# Altium schematic sheet SH-C30A-V1.21.SchDoc
size 420 x 297 mm; Symbol: Sheet-Symbol_A3; Company: DSD TECH; Version: V1.0; Page Size: A3; @Page No: 1; @Page Name: P1; @Project Name: CANable; @Page Count: 1; @Update Date: 2022-07-10; @Create Date: 2022-06-27; @Schematic Name: CANable; Device: Sheet-Symbol_A3; Border: 1; Width: 1655; Height: 1170; Region Start: 1; X Region Count: 6; Y Region Count: 4; Blade Width: 10; Title Block Position: 3
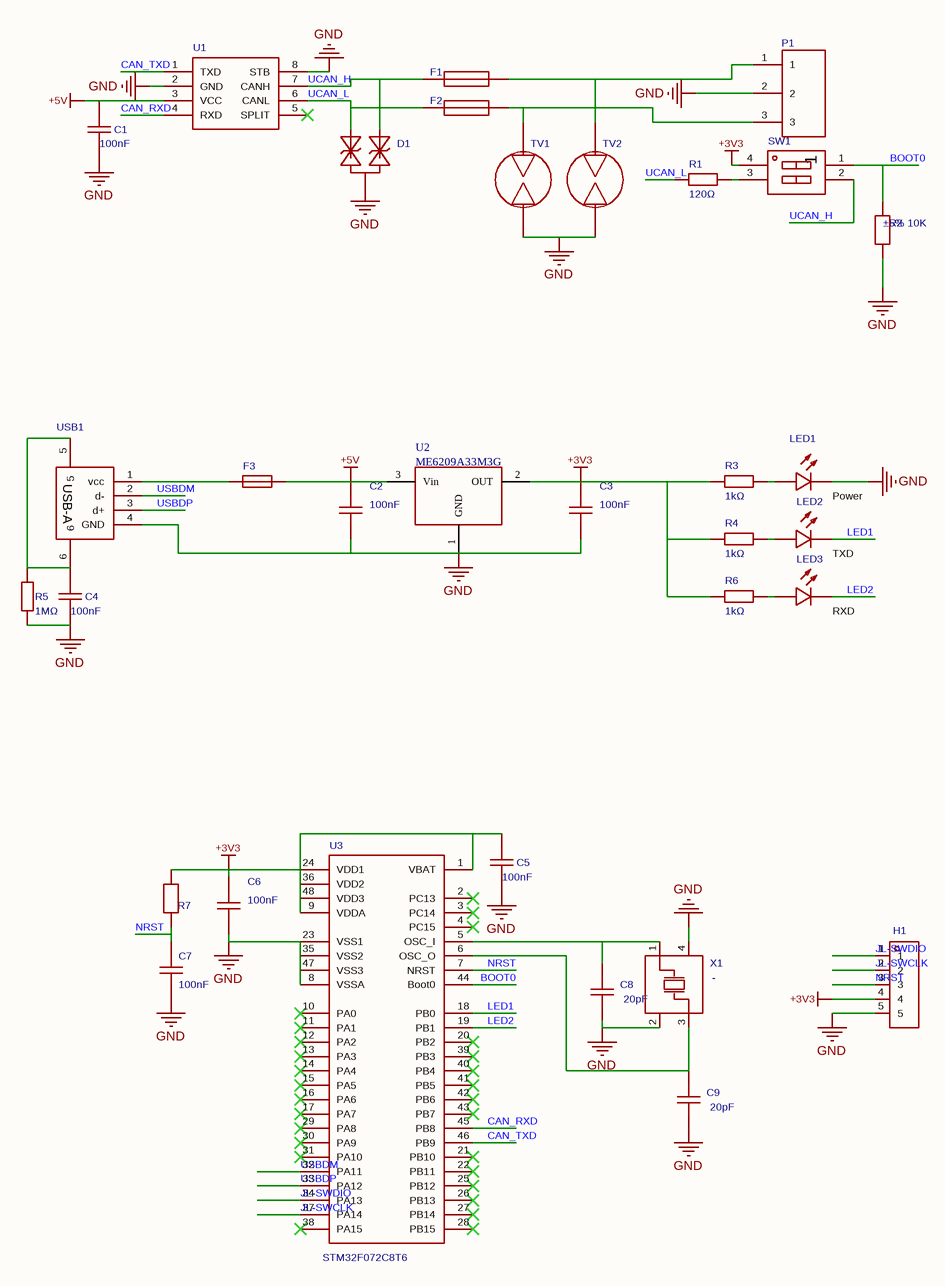
[diagram p0: SH-C30A-V1.21.SchDoc]

## Parts
C1  value 100nF  [C0402]
C2  value 100nF  [C0402]
C3  value 100nF  [C0402]
C4  value 100nF  [C0402]
C5  value 100nF  [C0402]
C6  value 100nF  [C0402]
C7  value 100nF  [C0402]
C8  value 20pF  [C0402]
C9  value 20pF  [C0402]
D1  (no value)  [SOT-23-3_L2.9-W1.3-P1.90-LS2.4-BR]
F1  (no value)  [F1206]
F2  (no value)  [F1206]
F3  (no value)  [F0805]
H1  (no value)  [HDR-TH_5P-P2.54-V-M]
LED1  (no value)  [LED0603-RD_RED]
LED2  (no value)  [LED0603-RD]
LED3  (no value)  [LED0603-RD]
P1  (no value)  [CONN-TH_3P-P3.81_WJ124-3.81-3P]
R1  value 120Ω  [R0805]
R2  LCSC Part Name: ±5% 10K  [R0402]
R3  value 1kΩ  [R0402]
R4  value 1kΩ  [R0402]
R5  value 1MΩ  [R0603]
R6  value 1kΩ  [R0402]
R7  (no value)  [R0402]
SW1  (no value)  [SW-TH_4P-L6.5-W9.6-P2.54-LS7.62]
TV1  (no value)  [DIO-DT-SMD_L4.5-W3.2]
TV2  (no value)  [DIO-DT-SMD_L4.5-W3.2]
U1  (no value)  [SOIC-8_L5.0-W4.0-P1.27-LS6.0-BL]
U2  ME6209A33M3G  [SOT-23(SOT-23-3)]
U3  (no value)  [LQFP-48_L7.0-W7.0-P0.50-LS9.0-BL]
USB1  (no value)  [USB-A-SMD_U-G-04WS-W-01]
X1  (no value)  [OSC-SMD_4P-L3.2-W2.5-BL]

## Nets
+3V3: C3.2 C5.2 C6.2 H1.4 R3.1 R4.1 R6.1 R7.2 SW1.4(PIN4) U2.2(OUT) U3.1(VBAT) U3.9(VDDA) U3.24(VDD1) U3.36(VDD2) U3.48(VDD3)
+5V: C1.2 C2.2 F3.2 U1.3(VCC) U2.3(Vin)
GND: C1.1 C2.1 C3.1 C4.1 C5.1 C6.1 C7.1 C8.2 C9.1 D1.3 H1.5 LED1.1(K) P1.2 R2.1 R5.1 TV1.2 TV2.2 U1.2(GND) U1.8(STB) U2.1(GND) U3.8(VSSA) U3.23(VSS1) U3.35(VSS2) U3.47(VSS3) USB1.4(GND) X1.2(GND) X1.4(GND)
BOOT0: R2.2 SW1.1(PIN1) U3.44(Boot0)
CAN_RXD: U1.4(RXD) U3.45(PB8)
CAN_TXD: U1.1(TXD) U3.46(PB9)
JL-SWCLK: H1.2 U3.37(PA14)
JL-SWDIO: H1.1 U3.34(PA13)
LED1: LED2.1(K) U3.18(PB0)
LED2: LED3.1(K) U3.19(PB1)
NRST: C7.2 H1.3 R7.1 U3.7(NRST)
UCAN_H: D1.1 F1.1 SW1.2(PIN2) U1.7(CANH)
UCAN_L: D1.2 F2.1 R1.1 U1.6(CANL)
USBDM: U3.32(PA11) USB1.2(d-)
USBDP: U3.33(PA12) USB1.3(d+)
NetC4_2: C4.2 R5.2 USB1.5 USB1.6
NetC8_1: C8.1 U3.5(OSC_I) X1.1(OSC1)
NetC9_2: C9.2 U3.6(OSC_O) X1.3(OSC2)
NetF1_2: F1.2 P1.1 TV2.1
NetF2_2: F2.2 P1.3 TV1.1
NetF3_1: F3.1 USB1.1(vcc)
NetLED1_2: LED1.2(A) R3.2
NetLED2_2: LED2.2(A) R4.2
NetLED3_2: LED3.2(A) R6.2
NetR1_2: R1.2 SW1.3(PIN3)

Not connected (* = marked no-connect by the designer): U1 5(SPLIT)*; U3 2(PC13)* 3(PC14)* 4(PC15)* 10(PA0)* 11(PA1)* 12(PA2)* 13(PA3)* 14(PA4)* 15(PA5)* 16(PA6)* 17(PA7)* 20(PB2)* 21(PB10)* 22(PB11)* 25(PB12)* 26(PB13)* 27(PB14)* 28(PB15)* 29(PA8)* 30(PA9)* 31(PA10)* 38(PA15)* 39(PB3)* 40(PB4)* 41(PB5)* 42(PB6)* 43(PB7)*

## Notes on the sheet
- (near LED1) Power
- (near LED2) TXD
- (near LED3) RXD
- 2022-07-10
- CANable
- P1
- 2022-06-27
- V1.0
- A3
- 1
- DSD TECH
- (in symbol U-G-04WS-W-01) USB-A

## Library data of the parts
C1-C7 = C0402X104K050T: Capacitance:100nF;Tolerance:±10%;Rated Voltage:50V;Temp. Coefficient:X7R;; Manufacturer: IHHEC; AddInBom: yes; ModelId: 36a51122f27c49738f86b3bfa98863e0; ModelName: C0402_L1.0-W0.5-H0.5; ModelTransform: 39.37,19.685,0,0,0,0,0,0,0; Tolerance: ±10%; Voltage Rated: 50V; Temperature Coefficient: X7R; Device: C0402X104K050T; Symbol: C0402X104K050T; LCSC Part Name: 100nF ±10% 50V; SupplierPart: C501838; ManufacturerPart: C0402X104K050T; Supplier Footprint: 0402; JLCPCB Part Class: Extended Part; Datasheet: https://atta.szlcsc.com/upload/public/pdf/source/20190313/C374174_331C86E4A68CC9C732DA87186AAF7F8A.pdf; Supplier: LCSC; ConvertToPcb: yes; FootprintName: C0402
C8 C9 = GRM1555C1H200JA01D: Capacitance:20pF;Tolerance:±5%;Rated Voltage:50V;Temp. Coefficient:C0G;; Manufacturer: muRata; AddInBom: yes; ModelId: 36a51122f27c49738f86b3bfa98863e0; ModelName: C0402_L1.0-W0.5-H0.5; ModelTransform: 39.37,19.685,0,0,0,0,0,0,0; Tolerance: ±5%; Voltage Rated: 50V; Temperature Coefficient: C0G; Device: GRM1555C1H200JA01D; Symbol: GRM1555C1H200JA01D; LCSC Part Name: 20pF ±5% 50V; SupplierPart: C76959; ManufacturerPart: GRM1555C1H200JA01D; Supplier Footprint: 0402; JLCPCB Part Class: Extended Part; Datasheet: https://atta.szlcsc.com/upload/public/pdf/source/20180307/C76959_15204091273971407747.pdf; Supplier: LCSC; ConvertToPcb: yes; FootprintName: C0402
D1 = TPPESD12VL2BT: Manufacturer: TECH PUBLIC; AddInBom: yes; ModelId: c62791f0466c4ae2a892c056b845b0ca; ModelName: SOT-23-3P_L2.9-W1.3-H1.0-LS2.4-P0.95; ModelTransform: 98.425,114.173,0,180,0,0,0.0005,-0.0005,0; Device: TPPESD12VL2BT; Symbol: TPPESD12VL2BT; LCSC Part Name: TPPESD12VL2BT; SupplierPart: C2682273; ManufacturerPart: TPPESD12VL2BT; Supplier Footprint: SOT-23-3; JLCPCB Part Class: Extended Part; Datasheet: https://atta.szlcsc.com/upload/public/pdf/source/20210810/22D0EE7AE03C1C968B9C50DDF599EB08.pdf; Supplier: LCSC; ConvertToPcb: yes; FootprintName: SOT-23-3_L2.9-W1.3-P1.90-LS2.4-BR
F1 F2 = BSMD1206-020-24V: Max Voltage:24V;Hold Current:200mA;Max Current:40A;Power Dissipation:600mW;Operating Temp.:-40~+85;Trip Current:460mA;Initial Resistance (min):350mΩ;Max Trip Time:100ms;Post-trip Resistance (max):2.7Ω;; Manufacturer: BHFUSE; AddInBom: yes; ModelId: f1628daad26847a79b887277a2bc8541; ModelName: F1206_L3.2-W1.7-H0.6; ModelTransform: 126,66.9,0,0,0,0,0,0,0; Operating Voltage (Max): 24V; Hold Current: 200mA; Current Rating (Max): 40A; Power Dissipation: 600mW; Trip Current: 460mA; Resistance - Initial (Ri) (Min): 350mΩ; Maximum Time to Trip: 100ms; Resistance - Post Trip (R1) (Max): 2.7Ω; Operating Temperature: -40~+85; Device: BSMD1206-020-24V; Symbol: BSMD1206-020-24V; LCSC Part Name: 1206 0.2A 24V; SupplierPart: C883117; ManufacturerPart: BSMD1206-020-24V; Supplier Footprint: 1206; JLCPCB Part Class: Extended Part; Datasheet: https://atta.szlcsc.com/upload/public/pdf/source/20210323/C976306_14EC47BF6884C9FF1739F1E3CC0B530C.pdf; Supplier: LCSC; ConvertToPcb: yes; FootprintName: F1206
F3 = FSMD010-24-0805-R: Max Voltage:24V;Max Current:100A;Hold Current:100mA;Trip Current:300mA;; Manufacturer: FUZETEC; AddInBom: yes; ModelId: 57e2aa106f9143e8b6ab832aebb31c78; ModelName: F0805_L2.1-W1.4-H0.8; ModelTransform: 82.677,55.118,0,0,0,0,0.0005,0,0; Operating Voltage (Max): 24V; Current Rating (Max): 100A; Hold Current: 100mA; Trip Current: 300mA; Device: FSMD010-24-0805-R; Symbol: FSMD010-24-0805-R; LCSC Part Name: 0.1A 24V resettable fuse; SupplierPart: C220142; ManufacturerPart: FSMD010-24-0805-R; Supplier Footprint: 0805; JLCPCB Part Class: Extended Part; Datasheet: https://atta.szlcsc.com/upload/public/pdf/source/20180530/C220142_CDCC5931C174CCAFFDB29D784E09FABB.PDF; Supplier: LCSC; ConvertToPcb: yes; FootprintName: F0805
H1 = PZ254V-11-05P: Pitch:2.54mm;Total Pins:5;Rows:1;Pin Configuration:1x5P;Row Spacing:-;Mounting Type:Through Hole;Round Pin/Square Pin:Square Pin;Rated Current:-;Rated Voltage:-;Mating Pin Length:6mm;Insulator Height:2.5mm;Termination Pin Length:3mm;Contact Material:Brass;Contact Plating:-;Operating Temp. Range:-40~+105;Color:Black;; Manufacturer: XFCN; AddInBom: yes; ModelId: 47d466e4a34f4fc5bc626cf773a24dd5; ModelName: HDR-TH_5P-P2.54-M-LI-1X5P; ModelTransform: 499.999,100,0,0,0,0,0,0,-118.11; Pitch: 2.54mm; Pin Structure: 1x5P; Operating Temperature Range: -40~+105; Device: PZ254V-11-05P; Symbol: PZ254V-11-05P; LCSC Part Name: 2.54mm 1x5P; SupplierPart: C492404; ManufacturerPart: PZ254V-11-05P; Supplier Footprint: Through Hole,P=2.54mm; JLCPCB Part Class: Extended Part; Datasheet: https://atta.szlcsc.com/upload/public/pdf/source/20200309/C492404_E51533260F8710EFF5D4617281164C1D.pdf; Supplier: LCSC; ConvertToPcb: yes; FootprintName: HDR-TH_5P-P2.54-V-M; Number of Pins: 5; Number of Rows: 1; Row Spacing: -; Mounting Type: Through Hole; Circluar Pins/Square Pins: Square Pin; Current Rating (Max): -; Voltage Rating (Max): -; Length of Mating Pin: 6mm; Insulation Height: 2.5mm; Length of End Connection Pin: 3mm; Contact Material: Brass; Contact Plating: -; Color: Black
LED1 = NCD0603R1_C84263: Emitted Color:Red;; Manufacturer: NationStar; Symbol: FC-DA1608HRK-620D; AddInBom: yes; ModelId: 74041d3a270d435c8600a9ab9b7641c0; ModelTransform: 63.7794,31.496,0,0,0,0,0,0,0; Emitted Color: Red; Device: NCD0603R1_C84263; LCSC Part Name: Red; SupplierPart: C84263; ManufacturerPart: NCD0603R1; Supplier Footprint: 0603; JLCPCB Part Class: Extended Part; Datasheet: https://atta.szlcsc.com/upload/public/pdf/source/20200820/C84263_DABC6A75E58F576973B407FDBA283D60.pdf; Supplier: LCSC; ConvertToPcb: yes; FootprintName: LED0603-RD_RED; ModelName: LED0603-RD_RED
LED2 LED3 = NCD0603G1: Emitted Color:Emerald Green;; Manufacturer: NationStar; Symbol: FC-D1608UGK-520D10; AddInBom: yes; ModelId: 1f0d29a91be547639d425604e9b96ebb; ModelTransform: 63.7794,32.283,0,0,0,0,0,0,0; Device: NCD0603G1; LCSC Part Name: Emerald Green; SupplierPart: C84267; ManufacturerPart: NCD0603G1; Supplier Footprint: 0603; JLCPCB Part Class: Extended Part; Datasheet: https://atta.szlcsc.com/upload/public/pdf/source/20200820/C84267_04BA7703640BAC111D09F5EFB971FBF3.pdf; Supplier: LCSC; ConvertToPcb: yes; FootprintName: LED0603-RD; ModelName: LED0603-RD; Emitted Color: Emerald Green
P1 = WJ124-3.81-3P: Pitch:3.81mm;Rows:1;Pins per Row:3;Mounting:Straight;Rated Current:15A;Rated Voltage:300V;Wire Gauge - AWG:14~30;Wire Gauge - mm?:1.5;Operating Temp. Range:-40~+105;Color:Green;; Manufacturer: KANGNEX; AddInBom: yes; ModelId: 09065bb11f2443318818d6a3b154f95c; ModelName: CONN-TH_WJ3.81-LI-3P-124; ModelTransform: 469.7,287.4,0,90,0,0,2,-9.8,-157.5; Pitch: 3.81mm; Number of PINs Per Row: 3; Current Rating (Max): 15A; Voltage Rating (Max): 300V; Wire Gauge - AWG: 14~30; Wire Gauge - mm?: 1.5; Operating Temperature Range: -40~+105; Device: WJ124-3.81-3P; Symbol: WJ124-3.81-3P; LCSC Part Name: 3.81mm Rows:1 Pins per Row:3 Straight stackable; SupplierPart: C36780; ManufacturerPart: WJ124-3.81-3P; Supplier Footprint: P=3.81mm; JLCPCB Part Class: Extended Part; Datasheet: https://atta.szlcsc.com/upload/public/pdf/source/20191225/C36780_C6A965E5CD5B8ACE599A8EDC0C9E48CC.pdf; Supplier: LCSC; ConvertToPcb: yes; FootprintName: CONN-TH_3P-P3.81_WJ124-3.81-3P; Number of Rows: 1; Mounting Style: Straight; Color: Green
R1 = RC0805FR-07120RL: Tolerance:±1%;Temp. Coefficient:±100ppm/;Resistance:120Ω;Power:125mW;Max Working Voltage:150V;Operating Temp. Range:-55~+155;; Manufacturer: YAGEO; AddInBom: yes; ModelId: 37a81e68749a4138bd2dfa6897b24b85; ModelName: R0805_L2.0-W1.3-H0.6; ModelTransform: 78.74,51.181,0,0,0,0,0,-0.0005,0; Tolerance: ±1%; Power(Watts): 125mW; Overload Voltage (Max): 150V; Temperature Coefficient: ±100ppm/; Operating Temperature Range: -55~+155; Device: RC0805FR-07120RL; Symbol: RC0805FR-07120RL; LCSC Part Name: 120Ω ±1%; SupplierPart: C114245; ManufacturerPart: RC0805FR-07120RL; Supplier Footprint: 0805; JLCPCB Part Class: Extended Part; Datasheet: https://atta.szlcsc.com/upload/public/pdf/source/20170818/C114245_1503051136294895105.pdf; Supplier: LCSC; ConvertToPcb: yes; FootprintName: R0805
R2 R7 = SCR0402J10K: Manufacturer: VO; AddInBom: yes; ModelId: 671aefced39d4c318694bba8bd8efd39; ModelName: R0402_L1.0-W0.5-H0.5; ModelTransform: 39.37,19.685,0,0,0,0,0,0.0005,0; Device: SCR0402J10K; Symbol: SCR0402J10K; SupplierPart: C3017497; ManufacturerPart: SCR0402J10K; Supplier Footprint: 0402; JLCPCB Part Class: Extended Part; Datasheet: https://atta.szlcsc.com/upload/public/pdf/source/20220513/247AF9639BA21CF93567DC289CCC6A22.pdf; Supplier: LCSC; ConvertToPcb: yes; FootprintName: R0402
  R7: LCSC Part Name: ±5% 10K
R3 R4 R6 = RC0402JR-071KL: Resistance:1kΩ;Tolerance:±5%;Power:1/16W;Temp. Coefficient:±100ppm/;Max Working Voltage:50V;Operating Temp. Range:-55~+155;; Manufacturer: YAGEO; AddInBom: yes; ModelId: 671aefced39d4c318694bba8bd8efd39; ModelName: R0402_L1.0-W0.5-H0.5; ModelTransform: 39.37,19.685,0,0,0,0,0,0.0005,0; Tolerance: ±5%; Power(Watts): 1/16W; Overload Voltage (Max): 50V; Device: RC0402JR-071KL; Temperature Coefficient: ±100ppm/; Operating Temperature Range: -55~+155; Symbol: RC0402JR-071KL; LCSC Part Name: 1kΩ ±5%; SupplierPart: C105637; ManufacturerPart: RC0402JR-071KL; Supplier Footprint: 0402; JLCPCB Part Class: Extended Part; Datasheet: https://atta.szlcsc.com/upload/public/pdf/source/20170518/1495085707603.pdf; Supplier: LCSC; ConvertToPcb: yes; FootprintName: R0402
R5 = 0603WAJ0105T5E: Resistor Type:Thick Film Resistor;Resistance:1MΩ;Tolerance:±5%;Power:1/10W;Temp. Coefficient:±100ppm/;Max Working Voltage:75V;Operating Temp. Range:-55~+155;; Manufacturer: UNI-ROYAL; AddInBom: yes; ModelId: 3281a289d46d4bb1877be1eabd090e13; ModelName: R0603_L1.6-W0.8-H0.8; ModelTransform: 62.992,31.496,0,0,0,0,0,0,0; Tolerance: ±5%; Power(Watts): 1/10W; Overload Voltage (Max): 75V; Temperature Coefficient: ±100ppm/; Operating Temperature Range: -55~+155; Device: 0603WAJ0105T5E; Symbol: 0603WAJ0105T5E; LCSC Part Name: 1MΩ ±5%; SupplierPart: C26098; ManufacturerPart: 0603WAJ0105T5E; Supplier Footprint: 0603; JLCPCB Part Class: Extended Part; Datasheet: https://atta.szlcsc.com/upload/public/pdf/source/20200306/C422600_1E6D84923E4A46A82E41ADD87F860B5C.pdf; Supplier: LCSC; ConvertToPcb: yes; FootprintName: R0603; Type: Thick Film Resistor
SW1 = DP-02BP: Type:Piano Key;Rated Current:25mA;Rated Voltage:24V;Circuit:SPST;Positions:2;Pin Pitch:2.54mm;Operating Temp.:-20~+70;Service Life:3000;Color:Blue;; Manufacturer: HRO; Symbol: DP-02BP_C458093; AddInBom: yes; ModelId: 15dcb542fdea46d3bca4facf51fa32cb; ModelName: SW-TH_4P-L6.5-W12.0-H9.7-P2.54; ModelTransform: 257.5,472.4,0,0,0,0,0,-45.3,-153.5; Current Rating: 25mA; Voltage Rating: 24V; Circuit: SPST; Number of Positions: 2; Operating Life: 3000; Operating Temperature: -20~+70; Device: DP-02BP; LCSC Part Name: Blue 2-position 2.54mm through-hole side-actuated DIP switch; SupplierPart: C458093; ManufacturerPart: DP-02BP; Supplier Footprint: Through Hole; JLCPCB Part Class: Extended Part; Datasheet: https://atta.szlcsc.com/upload/public/pdf/source/20210810/79AA2E1F6EDC519505AF8DF4F29ADEEB.pdf; Supplier: LCSC; ConvertToPcb: yes; FootprintName: SW-TH_4P-L6.5-W9.6-P2.54-LS7.62; Type: Piano Key; Lead Pitch: 2.54mm; Color: Blue
TV1 TV2 = SMD4532-090NF: Electrodes:2;DC Breakdown Voltage:90V;Tolerance:±30%;Pulse Discharge Current:3kA;Interelectrode Capacitance:0.5pF;; Manufacturer: RUILON; AddInBom: yes; ModelId: 3e98048e62f042eda67deea78d2be460; ModelName: DIO-DT_L4.5-W3.2-H2.7; ModelTransform: 177.2,126,0,0,0,0,0,0,0; Number of Poles: 2; DC Spark-over Voltage: 90V; Tolerance: ±30%; Nominal Impulse Discharge Current: 3kA; Maximum Capacitance @ 1MHz: 0.5pF; Device: SMD4532-090NF; Symbol: SMD4532-090NF; LCSC Part Name: 90V; SupplierPart: C9235; ManufacturerPart: SMD4532-090NF; Supplier Footprint: 1812; JLCPCB Part Class: Extended Part; Datasheet: https://atta.szlcsc.com/upload/public/pdf/source/20140725/1457707194440.pdf; Supplier: LCSC; ConvertToPcb: yes; FootprintName: DIO-DT-SMD_L4.5-W3.2
U1 = TJA1040T/CM,118: Type:Transceiver;Protocol:CAN Bus;; Manufacturer: NXP; AddInBom: yes; ModelId: e81d2f7d937b4a6ab1dca543ff5d56a4; ModelName: SOIC-8_L4.9-W3.9-H1.7-LS6.0-P1.27; ModelTransform: 189.751,236.22,0,0,0,0,-0.0005,0.0005,0; Protocol: CAN Bus; Supply Voltage: 4.75V ~ 5.25V; Device: TJA1040T/CM,118; Symbol: TJA1040T/CM,118; LCSC Part Name: TJA1040T/CM,118; SupplierPart: C6951; ManufacturerPart: TJA1040T/CM,118; Supplier Footprint: SOIC-8_150mil; JLCPCB Part Class: Extended Part; Datasheet: https://atta.szlcsc.com/upload/public/pdf/source/20140819/1457707229647.pdf; Supplier: LCSC; ConvertToPcb: yes; FootprintName: SOIC-8_L5.0-W4.0-P1.27-LS6.0-BL; Type: Transceiver
U2 = ME6209A33M3G: ConvertToPcb: yes; Origin Footprint: SOT-23(SOT-23-3); Device: ME6209A33M3G; Symbol: ME6209A33M3G; AddInBom: yes
U3 = STM32F072C8T6: CPU Core:ARM® Cortex®-M0;Supply Voltage:1.65V ~ 3.6V;; Manufacturer: ST; AddInBom: yes; ModelId: 093be70396ff421eb2cdb946d5311efc; ModelName: LQFP-48_L7.0-W7.0-H1.4-LS9.0-P0.50; ModelTransform: 354.331,354.331,0,0,0,0,0,0,0; Program Memory Size: 64KB; RAM Size: 16KB; Number of I/O: 37; A/D: 10x12bit; D/A: 2x12bit; PWM: 6; UART/USART: 4 USART; I2C (SMBUS/PMBUS): 2; USB Device: 1; Manufacturer Part: STM32F072C8T6; Device: STM32F072C8T6; Symbol: STM32F072C8T6; LCSC Part Name: STM32F072C8T6; SupplierPart: C80488; Supplier Footprint: LQFP-48_7x7x05P; JLCPCB Part Class: Extended Part; Datasheet: https://atta.szlcsc.com/upload/public/pdf/source/20160816/1471343013459.pdf; Supplier: LCSC; ConvertToPcb: yes; FootprintName: LQFP-48_L7.0-W7.0-P0.50-LS9.0-BL; Core Processor: ARM® Cortex®-M0; Voltage - Supply (Vcc/Vdd): 1.65V ~ 3.6V; CAN: 1; Features: I2S,HDMI CEC
USB1 = U-G-04WS-W-01: Connector Type:Type-A;Standard:USB 2.0;Gender:Male;Contacts:4;Ports:1;; Manufacturer: HRO; AddInBom: yes; ModelId: f6f4a0fb4b8446c28a8faf79888527ee; ModelName: USB-A-SMD_4P-L12.0-W18.8-H4.5-LS12.8; ModelTransform: 499.10806,816.927,0,90,0,0,324.783,0,-98.425; Connector Type: Type-A; Gender: Male; Number of Contacts: 4; Number of Ports: 1; Device: U-G-04WS-W-01; Symbol: U-G-04WS-W-01; LCSC Part Name: Type-A Male; SupplierPart: C97324; ManufacturerPart: U-G-04WS-W-01; Supplier Footprint: SMD; JLCPCB Part Class: Extended Part; Datasheet: https://atta.szlcsc.com/upload/public/pdf/source/20210810/086B58784C0648AAD520661969CA1CDC.pdf; Supplier: LCSC; ConvertToPcb: yes; FootprintName: USB-A-SMD_U-G-04WS-W-01; Standard: USB 2.0
X1 = SX32Y024000BC1T: Crystal Type:-;Frequency:-;Frequency Tolerance:-;Frequency Stability:-;Load Capacitance:-;Operating Temp.:-;; Manufacturer: TKD; AddInBom: yes; ModelId: ae22b8d143894765bc8100c37cb6356f; ModelName: OSC-SMD_4P-L3.2-W2.5-H1.0; ModelTransform: 125.984,98.425,0,0,0,0,0,0.005,0; LCSC Part Name: 3225 24M 12PF  10ppm  -20 -75; Value: -; Device: SX32Y024000BC1T; Symbol: SX32Y024000BC1T; SupplierPart: C271629; ManufacturerPart: SX32Y024000BC1T; Supplier Footprint: SMD3225-4P; JLCPCB Part Class: Extended Part; Datasheet: https://atta.szlcsc.com/upload/public/pdf/source/20180829/C271629_CA81D930E8823EB83EE4F79A596DDEFE.pdf; Supplier: LCSC; ConvertToPcb: yes; FootprintName: OSC-SMD_4P-L3.2-W2.5-BL; Crystal Type: -; Frequency Tolerance: -; Frequency Stability: -; Load Capacitance: -; Operating Temperature: -